# EAGLE schematic RCShield-arm-v0 (EAGLE 6.3)
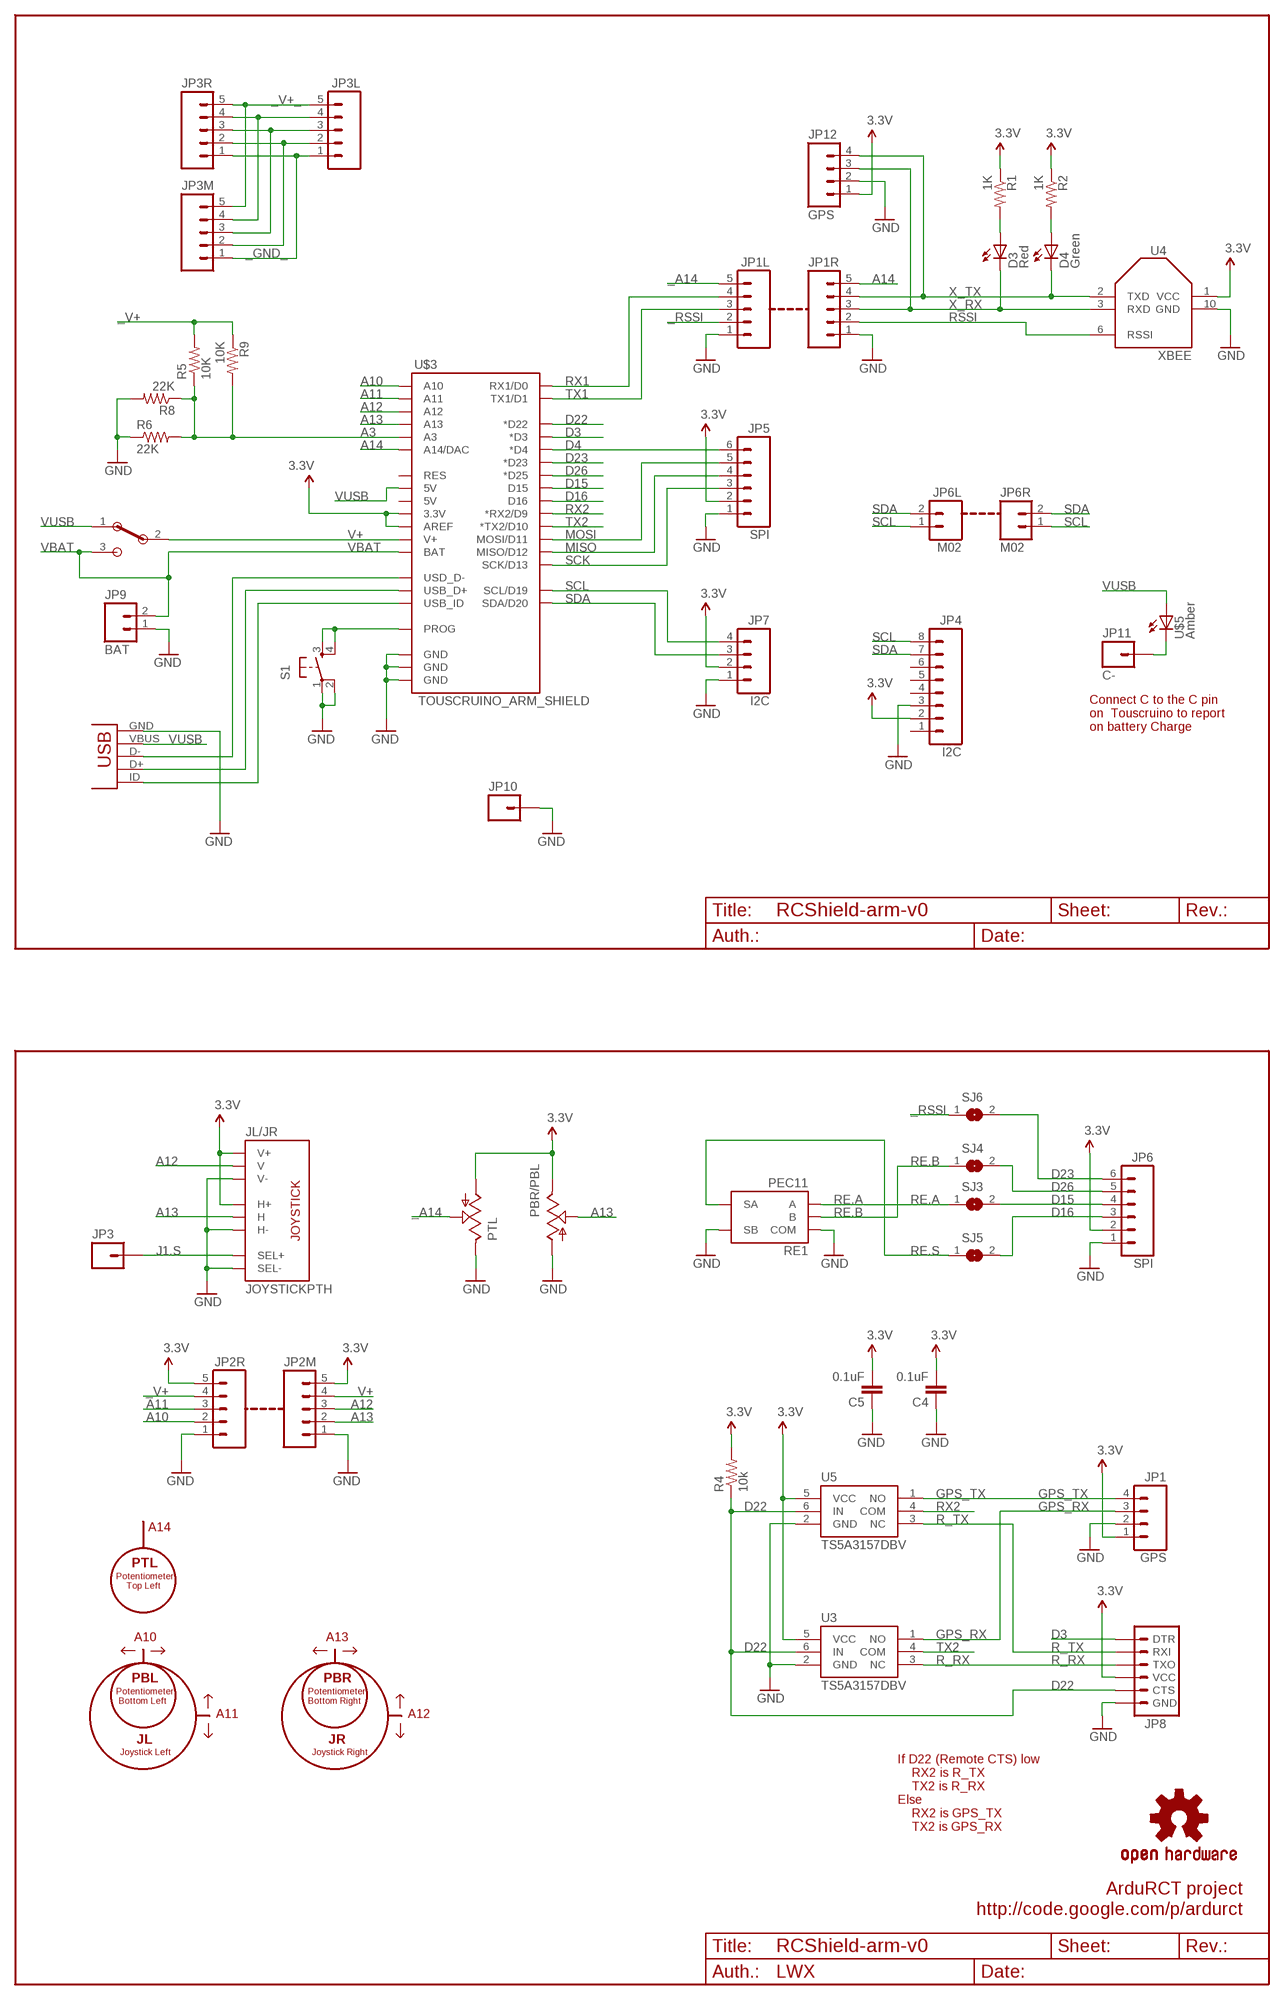
[diagram p0: schematic, sheet 1]

## Parts
C4  0.1uF  CAP0805  [0805]
C5  0.1uF  CAP0805  [0805]
D3  Red  LED  [LED]
D4  Green  LED  [LED]
JL/JR  JOYSTICKPTH  [JOYSTICK]
JP1  GPS  M04  [1X04]
JP1L  M05  [2+3]
JP1R  M05  [2+3]
JP2M  M05  [2+3]
JP2R  M05  [2+3]
JP3  M01PTH  [1X01]
JP3L  M05  [2+3]
JP3M  M05  [2+3]
JP3R  M05  [2+3]
JP4  I2C  M08  [1X08]
JP5  SPI  M06SIP  [1X06]
JP6  SPI  M06SIP  [1X06]
JP6L  M02  [1X02]
JP6R  M02  [1X02]
JP7  I2C  M04  [1X04]
JP8  ARDUINO_SERIAL_PROGRAM  [1X06_F]
JP9  BAT  M02  [1X02]
JP10  M01PTH  [1X01]
JP11  C-  M01PTH  [1X01]
JP12  GPS  M04  [1X04]
PBR/PBL  POT  [ALPS_POT]
PTL  POT  [ALPS_POT]
R1  1K  RESISTOR0805-RES  [0805]
R2  1K  RESISTOR0805-RES  [0805]
R4  10k  RESISTOR0805-RES  [0805]
R5  10K  RESISTOR0805-RES  [0805]
R6  22K  RESISTOR0805-RES  [0805]
R8  22K  R-US_0207/7  [0207/7]
R9  10K  R-US_0207/7  [0207/7]
RE1  PEC11  [PEC11]
S1  TAC_SWITCHPTH  [TACTILE-PTH]
S4  EG1224  [EG1224]
SJ3  SJ  [SJ]
SJ4  SJ  [SJ]
SJ5  SJ  [SJ]
SJ6  SJ  [SJ]
U3  TS5A3157DBV  [SOT23-6]
U4  XBEE  XBEE-RSSI  [XBEE-SMD]
U5  TS5A3157DBV  [SOT23-6]
U$1  OSHW-LOGOM  [OSHW-LOGO-M]
U$3  TOUSCRUINO_ARM_SHIELD  [TOUSCRUINO_ARM_SHIELD_SPLIT]
U$5  Amber  LED  [LED]
X1  USB  [USB-MICROB]

## Nets
3.3V: C4.2 C5.2 JL/JR.H1(H+) JL/JR.V1(V+) JP1.1 JP2M.5 JP2R.5 JP4.2 JP5.2 JP6.2 JP7.2 JP8.4(VCC) JP12.1 PBR/PBL.P$1(E) PTL.P$3(A) R1.1 R2.1 R4.2 U3.5(VCC) U4.1(VCC) U5.5(VCC) U$3.3.3V U$3.AREF
_A14: JP1L.5 PTL.P$2(S)
_GND_ [vcc]: JP3L.1 JP3M.1 JP3R.1
_RSSI: JP1L.2 SJ6.1
_V+: JP2R.4 R5.2 R9.1
_V+_: JP3L.5 JP3M.5 JP3R.5
A3: R5.1 R6.2 R8.1 R9.2 U$3.A3
A10: JP2R.2 U$3.A10
A11: JP2R.3 U$3.A11
A12: JL/JR.V2(V) JP2M.3 U$3.A12
A13: JL/JR.H2(H) JP2M.2 PBR/PBL.P$2(S) U$3.A13
A14: JP1R.5 U$3.A14(A14/DAC)
C-: JP11.1 U$5.C1(C)
D3: JP8.1(DTR) U$3.D3(*D3)
D4: JP5.6 U$3.D4(*D4)
D15: JP6.4 SJ3.2 U$3.D15
D16: JP6.3 SJ5.2 U$3.D16
D22: JP8.5(CTS) R4.1 U3.6(IN) U5.6(IN) U$3.D22(*D22)
D23: JP6.6 SJ6.2 U$3.D23(*D23)
D26: JP6.5 SJ4.2 U$3.D25(*D25)
GND [vcc]: C4.1 C5.1 JL/JR.B2A(SEL-) JL/JR.H3(H-) JL/JR.V3(V-) JP1.2 JP1L.1 JP1R.1 JP2M.1 JP2R.1 JP4.3 JP5.1 JP6.1 JP7.1 JP8.6(GND) JP9.1 JP10.1 JP12.2 PBR/PBL.P$3(A) PTL.P$1(E) R6.1 R8.2 RE1.C(COM) RE1.S2(SB) S1.1 S1.2 U3.2(GND) U4.10(GND) U5.2(GND) U$3.GND@0(GND) U$3.GND@1(GND) U$3.GND@2(GND) X1.GND
GPS_RX: JP1.3 U3.1(NO)
GPS_TX: JP1.4 U5.1(NO)
J1.S: JL/JR.B1A(SEL+) JP3.1
MISO: JP5.4 U$3.D12(MISO/D12)
MOSI: JP5.5 U$3.D11(MOSI/D11)
N$1: S1.3 S1.4 U$3.PROG
N$2: U$3.USB_D-(USD_D-) X1.D-
N$3: U$3.USB_D+ X1.D+
N$4: JP3L.4 JP3M.4 JP3R.4
N$5: JP3L.3 JP3M.3 JP3R.3
N$6: JP3L.2 JP3M.2 JP3R.2
N$9: U$3.USB_ID X1.ID
N$14: D3.A1(A) R1.2
N$25: D4.A1(A) R2.2
R_RX: JP8.3(TXO) U3.3(NC)
R_TX: JP8.2(RXI) U5.3(NC)
RE.A: RE1.A SJ3.1
RE.B: RE1.B SJ4.1
RE.S: RE1.S1(SA) SJ5.1
RSSI: JP1R.2 U4.6(RSSI)
RX1: JP1L.4 U$3.RX1/D0
RX2: U5.4(COM) U$3.D9(*RX2/D9)
SCK: JP5.3 U$3.D13(SCK/D13)
SCL: JP4.8 JP6L.1 JP6R.1 JP7.4 U$3.SCL(SCL/D19)
SDA: JP4.7 JP6L.2 JP6R.2 JP7.3 U$3.SDA(SDA/D20)
TX1: JP1L.3 U$3.TX1/D1
TX2: U3.4(COM) U$3.D10(*TX2/D10)
V+: JP2M.4 S4.2 U$3.V+
VBAT: JP9.2 S4.3 U$3.BAT
VUSB: S4.1 U$3.5V@1(5V) U$5.A1(A) X1.VBUS
X_RX: D3.C1(C) JP1R.3 JP12.3 U4.3(RXD)
X_TX: D4.C1(C) JP1R.4 JP12.4 U4.2(TXD)
Unconnected: JP4.1 JP4.4 JP4.5 JP4.6 U$3.5V@0(5V) U$3.RES

## Notes on the sheet
- Connect C to the C pin 
  on  Touscruino to report
  on battery Charge
- A14
- PTL
- Potentiometer
      Top Left
- A10 | A13
- PBL | PBR
- Potentiometer
   Bottom Left
- Potentiometer
  Bottom Right
- A11 | A12
- JL | JR
- Joystick Left | Joystick Right
- If D22 (Remote CTS) low
      RX2 is R_TX
      TX2 is R_RX
  Else
      RX2 is GPS_TX
      TX2 is GPS_RX
- ArduRCT project
- http://code.google.com/p/ardurct
- LWX

## Library data of the parts
C4 C5 = SparkFun:CAP: Capacitor Standard 0603 ceramic capacitor, and 0.1" leaded capacitor.
D3 D4 U$5 = wibauxl:LED
JL/JR = SparkFun:JOYSTICK: Thumb Joystick Joystick commonly found in PS2 controllers. Two pots and a select switch. Footprint proven. Spark Fun Electronics SKU : COM-09032
JP1 JP7 JP12 = wibauxl:M04
JP1L JP1R JP2M JP2R JP3L JP3M JP3R = wibauxl:M05
JP3 JP10 JP11 = SparkFun:M01: Header 1 Standard 1-pin 0.1" header. Use with straight break away headers (SKU : PRT-00116), right angle break away headers (PRT-00553), swiss pins (PRT-00743), machine pins (PRT-00117), and female headers (PRT-00115).
JP4 = wibauxl:M08
JP5 JP6 = SparkFun:M06: Header 6 Standard 6-pin 0.1" header. Use with straight break away headers (SKU : PRT-00116), right angle break away headers (PRT-00553), swiss pins (PRT-00743), machine pins (PRT-00117), and female headers (PRT-00115). Molex polarized connector foot print use with SKU : PRT-08094 with associated crimp pins and housings. NOTES ON THE VARIANTS LOCK and LOCK_LONGPADS... This footprint was designed to help hold the alignment of a through-hole component (i.e. 6-pin header) while soldering it into place. You may notice that each hole has been shifted either up or down by 0.005 of an inch from it's more standard position (which is a perfectly straight line). This slight alteration caused the pins (the squares in the middle) to touch the edges of the holes. Because they are alternating, it causes a "brace" to hold the component in place. 0.005 has proven to be the perfect amount of "off-center" position when using our standard breakaway headers. Although looks a little odd when you look at the bare footprint, once you have a header in there, the alteration is very hard to notice. Also, if you push a header all the way into place, it is covered up entirely on the bottom side. This idea of altering the position of holes to aid alignment will be further integrated into the Sparkfun Library for other footprints. It can help hold any component with 3 or more connection pins.
JP6L JP6R JP9 = wibauxl:M02
JP8 = wibauxl:ARDUINO_SERIAL_PROGRAM
PBR/PBL PTL = wibauxl:POT
R1 R2 R4-R6 = SparkFun:RESISTOR: Resistor Basic schematic elements and footprints for 0603, 1206, and PTH resistors.
R8 R9 = resistor:R-US_: RESISTOR, American symbol
RE1 = wibauxl:PEC11
S1 = SparkFun:TAC_SWITCH: Momentary Switch Button commonly used for reset or general input. Spark Fun Electronics SKU : COM-00097
S4 = wibauxl:EG1224
SJ3-SJ6 = jumper:SJ: SMD solder JUMPER
U3 U5 = wibauxl:TS5A3157DBV
U4 = wibauxl:XBEE-RSSI
U$1 = SparkFun:OSHW-LOGO: Open Source Hardware Logo This logo indicates the piece of hardware it is found on incorporates a OSHW license and/or adheres to the definition of open source hardware found here: http://freedomdefined.org/OSHW
U$3 = wibauxl:TOUSCRUINO_ARM_SHIELD
X1 = wibauxl:USB

## Net classes
0 default: width 0.203 mm
1 vcc: width 0.254 mm